# Altium project FlightController_F405.PrjPcb
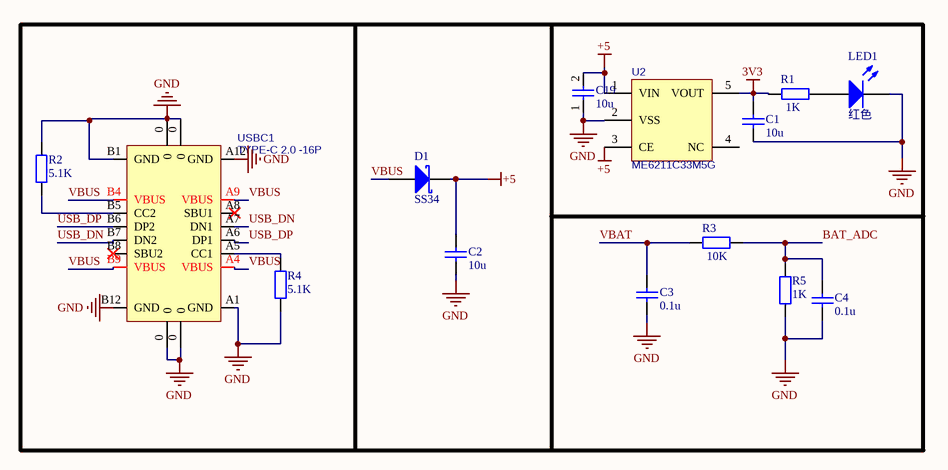
[diagram p0: Power.SchDoc]
4 sheets, 44 parts. Net scope: global (net labels, ports and power ports of the same name join across sheets).
Board file: FlightController_20x20.PcbDoc
Sheets:
  Power.SchDoc
  MCU_System.SchDoc
  IMU_Sensor.SchDoc
  Interfaces.SchDoc

## Sheet Power.SchDoc
size A4; SheetNumber: 1; SheetTotal: 4

### Parts
C1  10u  [C0402_M]
C2  10u  [C0402_M]
C3  0.1u  [C0402_M]
C4  0.1u  [C0402_M]
C19  10u  [C0402_M]
D1  SS34  [SOD-123]
LED1  红色  [LED0603_R]
R1  1K  [R0402_M]
R2  5.1K  [R0402_M]
R3  10K  [R0402_M]
R4  5.1K  [R0402_M]
R5  1K  [R0402_M]
U2  ME6211C33M5G  [SOT-23-5]
USBC1  TYPE-C 2.0 -16P  [USB-C-SMD_16P]

### Nets
3V3: C1.2 R1.1 U2.5(VOUT)
+5: C2.2 C19.2 D1.2(K) U2.1(VIN) U2.3(CE)
GND: C1.1 C2.1 C3.1 C4.2 C19.1 LED1.2(K) R2.2 R4.1 R5.1 U2.2(VSS) USBC1.0 USBC1.A1(GND) USBC1.A12(GND) USBC1.B1(GND) USBC1.B12(GND)
BAT_ADC: C4.1 R3.2 R5.2
USB_DN: USBC1.A7(DN1) USBC1.B7(DN2)
USB_DP: USBC1.A6(DP1) USBC1.B6(DP2)
VBAT: C3.2 R3.1
VBUS: D1.1(A) USBC1.A4(VBUS) USBC1.A9(VBUS) USBC1.B4(VBUS) USBC1.B9(VBUS)
NetLED1_1: LED1.1(A) R1.2
NetR2_1: R2.1 USBC1.B5(CC2)
NetR4_2: R4.2 USBC1.A5(CC1)

Not connected (* = marked no-connect by the designer): U2 4(NC); USBC1 A8(SBU1)* B8(SBU2)*

### Library data of the parts
C1-C4 C19 = C: 贴片电容/MLCC电容; BOM名称: 无极性贴片电容; 当前库版本V2022.12.25 @淘宝卖家:黄晶宝石: 最新版本发布https://shop463601444.taobao.com
D1 = SS34: 肖特基二极管; 属性: 40V/3A; 当前库版本V2022.12.25 @淘宝卖家:黄晶宝石: 最新版本发布https://shop463601444.taobao.com; BOM名称: 肖特基二极管
LED1 = LED: 贴片LED; 封装库来自淘宝卖家：黄晶宝石: 其他店铺购入均为盗版封装库，无更新权益，请立即申请退款，本店现金奖励200~1000元; BOM名称: 贴片LED
R1-R5 = R: 贴片电阻; 联系下单店铺卖家 免费帮你查找封装: 联系下单店铺卖家 免费技术支持; BOM名称: 贴片电阻
U2 = ME6211C33: LDO 3.3V/0.5A; BOM名称: RT9193-30GB; 当前库版本V2022.12.25 @淘宝卖家:黄晶宝石: 最新版本发布https://shop463601444.taobao.com
USBC1 = USB2.0_Type-C_16Pin: USB2.0_Type-C_16Pin母座; 当前库版本V2022.12.25 @淘宝卖家:黄晶宝石: 最新版本发布https://shop463601444.taobao.com

## Sheet MCU_System.SchDoc
size A4; SheetNumber: 2; SheetTotal: 4
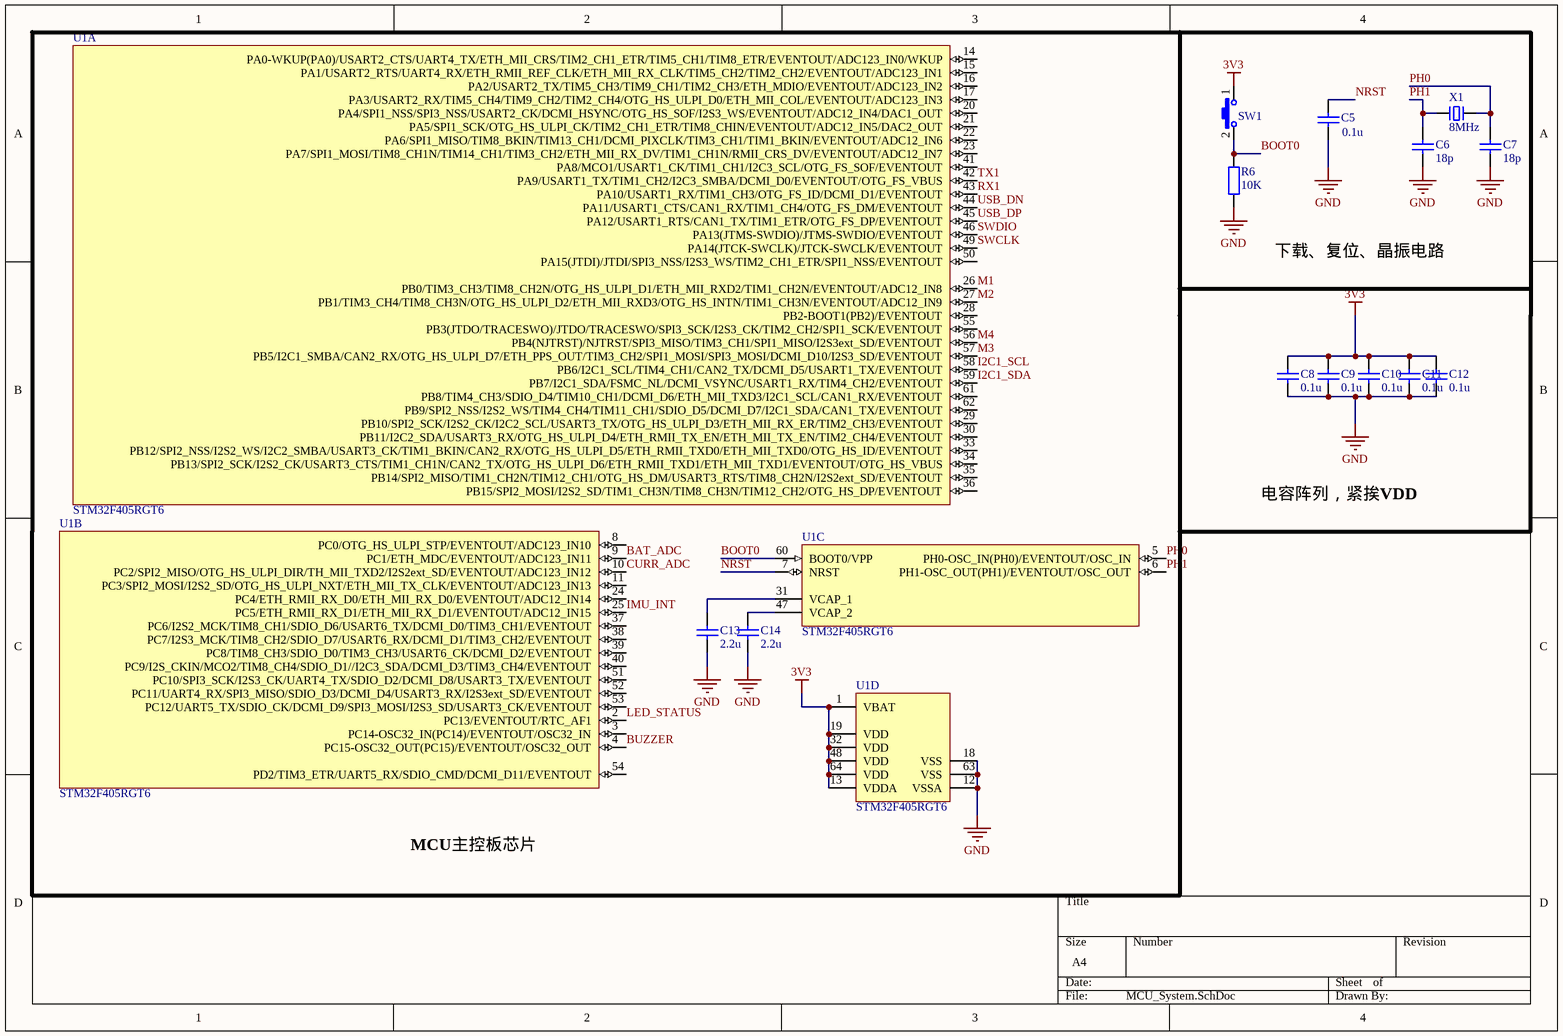
[diagram p1: MCU_System.SchDoc]

### Parts
C5  0.1u  [C0402_M]
C6  18p  [C0402_M]
C7  18p  [C0402_M]
C8  0.1u  [C0402_M]
C9  0.1u  [C0402_M]
C10  0.1u  [C0402_M]
C11  0.1u  [C0402_M]
C12  0.1u  [C0402_M]
C13  2.2u  [C0402_M]
C14  2.2u  [C0402_M]
R6  10K  [R0402_M]
SW1  3x6x5  [SW-SMD-2.8*2.4_4P]  (value not drawn)
U1  STM32F405RGT6  [TQFP64_M]  (parts A,B,C,D of 4)
X1  8MHz  [OSC-3225-4P]

### Nets
3V3: C8.2 C9.2 C10.2 C11.2 C12.2 SW1.1 U1.1(VBAT) U1.13(VDDA) U1.19(VDD) U1.32(VDD) U1.48(VDD) U1.64(VDD)
GND: C5.1 C6.1 C7.1 C8.1 C9.1 C10.1 C11.1 C12.1 C13.1 C14.1 R6.1 U1.12(VSSA) U1.18(VSS) U1.63(VSS)
BAT_ADC: U1.9(PC1/ETH_MDC/EVENTOUT/ADC123_IN11)
BOOT0: R6.2 SW1.2 U1.60(BOOT0/VPP)
BUZZER: U1.4(PC15-OSC32_OUT(PC15)/EVENTOUT/OSC32_OUT)
CURR_ADC: U1.10(PC2/SPI2_MISO/OTG_HS_ULPI_DIR/TH_MII_TXD2/I2S2ext_SD/EVENTOUT/ADC123_IN12)
I2C1_SCL: U1.58(PB6/I2C1_SCL/TIM4_CH1/CAN2_TX/DCMI_D5/USART1_TX/EVENTOUT)
I2C1_SDA: U1.59(PB7/I2C1_SDA/FSMC_NL/DCMI_VSYNC/USART1_RX/TIM4_CH2/EVENTOUT)
IMU_INT: U1.25(PC5/ETH_RMII_RX_D1/ETH_MII_RX_D1/EVENTOUT/ADC12_IN15)
LED_STATUS: U1.2(PC13/EVENTOUT/RTC_AF1)
M1: U1.26(PB0/TIM3_CH3/TIM8_CH2N/OTG_HS_ULPI_D1/ETH_MII_RXD2/TIM1_CH2N/EVENTOUT/ADC12_IN8)
M2: U1.27(PB1/TIM3_CH4/TIM8_CH3N/OTG_HS_ULPI_D2/ETH_MII_RXD3/OTG_HS_INTN/TIM1_CH3N/EVENTOUT/ADC12_IN9)
M3: U1.57(PB5/I2C1_SMBA/CAN2_RX/OTG_HS_ULPI_D7/ETH_PPS_OUT/TIM3_CH2/SPI1_MOSI/SPI3_MOSI/DCMI_D10/I2S3_SD/EVENTOUT)
M4: U1.56(PB4(NJTRST)/NJTRST/SPI3_MISO/TIM3_CH1/SPI1_MISO/I2S3ext_SD/EVENTOUT)
NRST: C5.2 U1.7(NRST)
PH0: C7.2 U1.5(PH0-OSC_IN(PH0)/EVENTOUT/OSC_IN) X1.3
PH1: C6.2 U1.6(PH1-OSC_OUT(PH1)/EVENTOUT/OSC_OUT) X1.1
RX1: U1.43(PA10/USART1_RX/TIM1_CH3/OTG_FS_ID/DCMI_D1/EVENTOUT)
SWCLK: U1.49(PA14(JTCK-SWCLK)/JTCK-SWCLK/EVENTOUT)
SWDIO: U1.46(PA13(JTMS-SWDIO)/JTMS-SWDIO/EVENTOUT)
TX1: U1.42(PA9/USART1_TX/TIM1_CH2/I2C3_SMBA/DCMI_D0/EVENTOUT/OTG_FS_VBUS)
USB_DN: U1.44(PA11/USART1_CTS/CAN1_RX/TIM1_CH4/OTG_FS_DM/EVENTOUT)
USB_DP: U1.45(PA12/USART1_RTS/CAN1_TX/TIM1_ETR/OTG_FS_DP/EVENTOUT)
NetC13_2: C13.2 U1.31(VCAP_1)
NetC14_2: C14.2 U1.47(VCAP_2)

Not connected (* = marked no-connect by the designer): U1 3(PC14-OSC32_IN(PC14)/EVENTOUT/OSC32_IN) 8(PC0/OTG_HS_ULPI_STP/EVENTOUT/ADC123_IN10) 11(PC3/SPI2_MOSI/I2S2_SD/OTG_HS_ULPI_NXT/ETH_MII_TX_CLK/EVENTOUT/ADC123_IN13) 14(PA0-WKUP(PA0)/USART2_CTS/UART4_TX/ETH_MII_CRS/TIM2_CH1_ETR/TIM5_CH1/TIM8_ETR/EVENTOUT/ADC123_IN0/WKUP) 15(PA1/USART2_RTS/UART4_RX/ETH_RMII_REF_CLK/ETH_MII_RX_CLK/TIM5_CH2/TIM2_CH2/EVENTOUT/ADC123_IN1) 16(PA2/USART2_TX/TIM5_CH3/TIM9_CH1/TIM2_CH3/ETH_MDIO/EVENTOUT/ADC123_IN2) 17(PA3/USART2_RX/TIM5_CH4/TIM9_CH2/TIM2_CH4/OTG_HS_ULPI_D0/ETH_MII_COL/EVENTOUT/ADC123_IN3) 20(PA4/SPI1_NSS/SPI3_NSS/USART2_CK/DCMI_HSYNC/OTG_HS_SOF/I2S3_WS/EVENTOUT/ADC12_IN4/DAC1_OUT) 21(PA5/SPI1_SCK/OTG_HS_ULPI_CK/TIM2_CH1_ETR/TIM8_CHIN/EVENTOUT/ADC12_IN5/DAC2_OUT) 22(PA6/SPI1_MISO/TIM8_BKIN/TIM13_CH1/DCMI_PIXCLK/TIM3_CH1/TIM1_BKIN/EVENTOUT/ADC12_IN6) 23(PA7/SPI1_MOSI/TIM8_CH1N/TIM14_CH1/TIM3_CH2/ETH_MII_RX_DV/TIM1_CH1N/RMII_CRS_DV/EVENTOUT/ADC12_IN7) 24(PC4/ETH_RMII_RX_D0/ETH_MII_RX_D0/EVENTOUT/ADC12_IN14) 28(PB2-BOOT1(PB2)/EVENTOUT) 29(PB10/SPI2_SCK/I2S2_CK/I2C2_SCL/USART3_TX/OTG_HS_ULPI_D3/ETH_MII_RX_ER/TIM2_CH3/EVENTOUT) 30(PB11/I2C2_SDA/USART3_RX/OTG_HS_ULPI_D4/ETH_RMII_TX_EN/ETH_MII_TX_EN/TIM2_CH4/EVENTOUT) 33(PB12/SPI2_NSS/I2S2_WS/I2C2_SMBA/USART3_CK/TIM1_BKIN/CAN2_RX/OTG_HS_ULPI_D5/ETH_RMII_TXD0/ETH_MII_TXD0/OTG_HS_ID/EVENTOUT) 34(PB13/SPI2_SCK/I2S2_CK/USART3_CTS/TIM1_CH1N/CAN2_TX/OTG_HS_ULPI_D6/ETH_RMII_TXD1/ETH_MII_TXD1/EVENTOUT/OTG_HS_VBUS) 35(PB14/SPI2_MISO/TIM1_CH2N/TIM12_CH1/OTG_HS_DM/USART3_RTS/TIM8_CH2N/I2S2ext_SD/EVENTOUT) 36(PB15/SPI2_MOSI/I2S2_SD/TIM1_CH3N/TIM8_CH3N/TIM12_CH2/OTG_HS_DP/EVENTOUT) 37(PC6/I2S2_MCK/TIM8_CH1/SDIO_D6/USART6_TX/DCMI_D0/TIM3_CH1/EVENTOUT) 38(PC7/I2S3_MCK/TIM8_CH2/SDIO_D7/USART6_RX/DCMI_D1/TIM3_CH2/EVENTOUT) 39(PC8/TIM8_CH3/SDIO_D0/TIM3_CH3/USART6_CK/DCMI_D2/EVENTOUT) 40(PC9/I2S_CKIN/MCO2/TIM8_CH4/SDIO_D1//I2C3_SDA/DCMI_D3/TIM3_CH4/EVENTOUT) 41(PA8/MCO1/USART1_CK/TIM1_CH1/I2C3_SCL/OTG_FS_SOF/EVENTOUT) 50(PA15(JTDI)/JTDI/SPI3_NSS/I2S3_WS/TIM2_CH1_ETR/SPI1_NSS/EVENTOUT) 51(PC10/SPI3_SCK/I2S3_CK/UART4_TX/SDIO_D2/DCMI_D8/USART3_TX/EVENTOUT) 52(PC11/UART4_RX/SPI3_MISO/SDIO_D3/DCMI_D4/USART3_RX/I2S3ext_SD/EVENTOUT) 53(PC12/UART5_TX/SDIO_CK/DCMI_D9/SPI3_MOSI/I2S3_SD/USART3_CK/EVENTOUT) 54(PD2/TIM3_ETR/UART5_RX/SDIO_CMD/DCMI_D11/EVENTOUT) 55(PB3(JTDO/TRACESWO)/JTDO/TRACESWO/SPI3_SCK/I2S3_CK/TIM2_CH2/SPI1_SCK/EVENTOUT) 61(PB8/TIM4_CH3/SDIO_D4/TIM10_CH1/DCMI_D6/ETH_MII_TXD3/I2C1_SCL/CAN1_RX/EVENTOUT) 62(PB9/SPI2_NSS/I2S2_WS/TIM4_CH4/TIM11_CH1/SDIO_D5/DCMI_D7/I2C1_SDA/CAN1_TX/EVENTOUT)

### Notes on the sheet
- 下载、复位、晶振电路
- 电容阵列，紧挨VDD
- MCU主控板芯片

### Library data of the parts
C5-C14 = C: as C1 on sheet Power
R6 = R: 贴片电阻; 联系下单店铺卖家 免费帮你查找封装: 联系下单店铺卖家 免费技术支持; BOM名称: 贴片电阻
SW1 = SW-PB: 微动开关; BOM名称: 3x6轻触开关; 联系下单店铺卖家 免费技术支持: 联系下单店铺卖家 免费帮你查找封装
U1 = STM32F405RGT6: ARM Cortex-M4 32b MCU+FPU, 210DMIP, 1024 kB Flash, 192+4 kB RAM, 51 I/Os, 64-pin LQFP, -40 to +85癈, Tray; Internal RAM: 192kB; Operating Frequency (Processor Speed): 168MHz; A/D Converter: 16x12-bit; D/A Converter: 2x12-bit; 16-bit Timers (IC/OC/PWM): 12x16-bit(24/24/30); 32-bit Timer (IC/OC/PWM): 2x32-bit (8/8/8); Other Timer Functions: 2xWDG, RTC, 24-bit down counter; Serial Interface: 3xSPI/2xI2S/2xI2C/3xUSART(IrDa, ISO7816)/3xUART/1xUSB OTG FS/HS, 2xCAN/ SDIO; 联系卖家，免费查找封装: 唯一出售店铺网址https://shop463601444.taobao.com; DatasheetVersion: rev2, Jan-2012; PackageVersion: 2012; PackageReference: TQFP64; PackageDescription: 64-Pin Low Profile Quad Flat Package, 10x10 mm Body, 0.5 mm Pitch; ComponentLink1Description: Manufacturer URL; ComponentLink1URL: http://www.st.com/; ComponentLink2Description: STM32F405/7 Datasheet; ComponentLink2URL: http://www.st.com/internet/com/TECHNICAL_RESOURCES/TECHNICAL_LITERATURE/DATASHEET/DM00037051.pdf; ComponentLink3Description: STM32F4 Web Page; ComponentLink3URL: http://www.st.com/internet/mcu/subclass/1521.jsp
X1 = XTAL-2P: 2脚无源晶振(谐振器）; 联系下单店铺卖家 免费帮你查找封装: 联系下单店铺卖家 免费技术支持; BOM名称: 2脚无源晶振(谐振器）

## Sheet IMU_Sensor.SchDoc
size A4; SheetNumber: 3; SheetTotal: 4
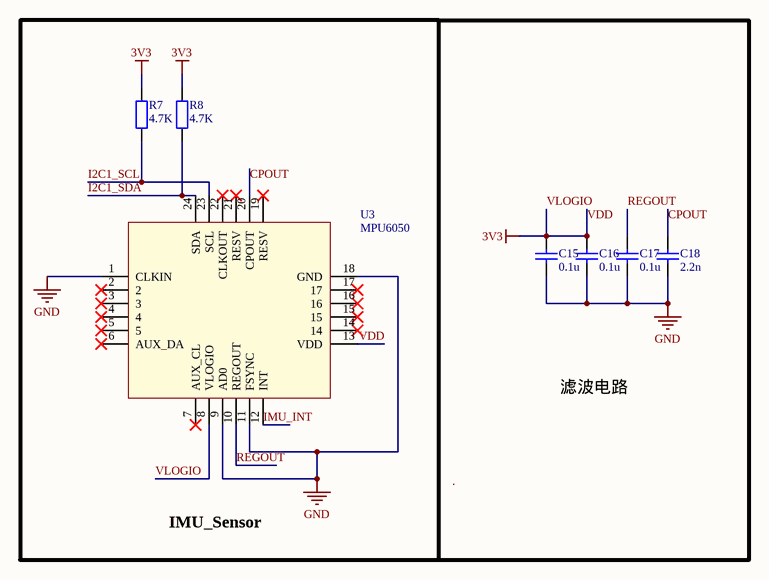
[diagram p2: IMU_Sensor.SchDoc]

### Parts
C15  0.1u  [C0402_M]
C16  0.1u  [C0402_M]
C17  0.1u  [C0402_M]
C18  2.2n  [C0402_M]
R7  4.7K  [R0402_M]
R8  4.7K  [R0402_M]
U3  MPU6050  [QFN-24_L4.0-W4.0-P0.50-BL-EP2.7]

### Nets
3V3: C15.2 C16.2 R7.2 R8.2 U3.8(VLOGIO) U3.13(VDD)  [also labelled VDD, VLOGIO]
GND: C15.1 C16.1 C17.1 C18.1 U3.1(CLKIN) U3.9(AD0) U3.11(FSYNC) U3.18(GND)
CPOUT: C18.2 U3.20(CPOUT)
I2C1_SCL: R7.1 U3.23(SCL)
I2C1_SDA: R8.1 U3.24(SDA)
IMU_INT: U3.12(INT)
REGOUT: C17.2 U3.10(REGOUT)

Not connected (* = marked no-connect by the designer): U3 2* 3* 4* 5* 6(AUX_DA)* 7(AUX_CL)* 14* 15* 16* 17* 19(RESV)* 21(RESV)* 22(CLKOUT)*

### Notes on the sheet
- 滤波电路
- IMU_Sensor
- Labels drawn without touching a wire or pin: ·

### Library data of the parts
C15-C18 = C: as C1 on sheet Power
R7 R8 = R: 贴片电阻; 联系下单店铺卖家 免费帮你查找封装: 联系下单店铺卖家 免费技术支持; BOM名称: 贴片电阻
U3 = MPU6050: 三轴加速度+三轴陀螺仪; 封装库来自淘宝卖家：黄晶宝石: 其他店铺购入均为盗版封装库，请立即申请退款，本店现金奖励100~500元; BOM名称: MPU6050

## Sheet Interfaces.SchDoc
size A4; SheetNumber: 4; SheetTotal: 4
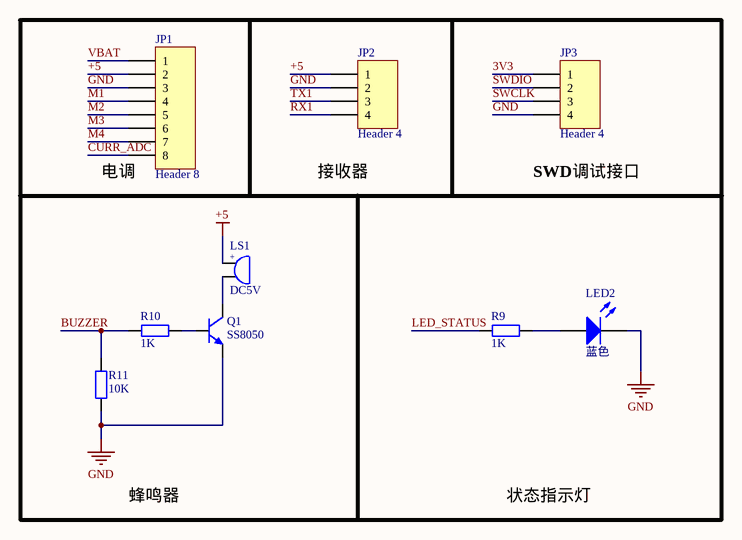
[diagram p3: Interfaces.SchDoc]

### Parts
JP1  Header 8  [SH1.0-WT-8P]
JP2  Header 4  [PAD-1X4-SMD]
JP3  Header 4  [PAD-1X4-SMD]
LED2  蓝色  [LED0603_B]
LS1  DC5V  [BUZZER]
Q1  SS8050  [SOT23-3L]
R9  1K  [R0402_M]
R10  1K  [R0402_M]
R11  10K  [R0402_M]

### Nets
3V3: JP3.1
+5: JP1.2 JP2.1 LS1.1
GND: JP1.3 JP2.2 JP3.4 LED2.2(K) Q1.2(E) R11.1
BUZZER: R10.1 R11.2
CURR_ADC: JP1.8
LED_STATUS: R9.1
M1: JP1.4
M2: JP1.5
M3: JP1.6
M4: JP1.7
RX1: JP2.4
SWCLK: JP3.3
SWDIO: JP3.2
TX1: JP2.3
VBAT: JP1.1
NetLED2_1: LED2.1(A) R9.2
NetLS1_2: LS1.2 Q1.3(C)
NetQ1_1: Q1.1(B) R10.2

### Notes on the sheet
- (near JP1) 电调
- (near JP2) 接收器
- (near JP3) SWD调试接口
- 蜂鸣器
- 状态指示灯
- (in symbol BEEP) +

### Library data of the parts
JP1 = Header 8: Header, 8-Pin; Revision: 17-Jul-2002: Re-released for DXP Platform.; Publisher: Altium Limited
JP2 JP3 = Header 4: Header, 4-Pin; Revision: 17-Jul-2002: Re-released for DXP Platform.; Publisher: Altium Limited
LED2 = LED: as LED1 on sheet Power; BOM名称: 贴片LED
LS1 = BEEP: 蜂鸣器; 联系下单店铺卖家 免费技术支持: 联系下单店铺卖家 免费帮你查找封装; BOM名称: 蜂鸣器
Q1 = 8050-SMD: 高频放大-NPN型; 参数: 40V 1.5A 1W 100MHZ; 联系下单店铺卖家 免费帮你查找封装: 联系下单店铺卖家 免费技术支持; BOM名称: 高频放大-NPN型
R9-R11 = R: 贴片电阻; 联系下单店铺卖家 免费帮你查找封装: 联系下单店铺卖家 免费技术支持; BOM名称: 贴片电阻

## Nets that join several sheets
3V3: Power (C1.2 R1.1 U2.5), MCU_System (12 pins), IMU_Sensor (6 pins), Interfaces (JP3.1)
+5: Power (5 pins), Interfaces (JP1.2 JP2.1 LS1.1)
GND: Power (15 pins), MCU_System (14 pins), IMU_Sensor (8 pins), Interfaces (6 pins)
BAT_ADC: Power (C4.1 R3.2 R5.2), MCU_System (U1.9)
BUZZER: MCU_System (U1.4), Interfaces (R10.1 R11.2)
CURR_ADC: MCU_System (U1.10), Interfaces (JP1.8)
I2C1_SCL: MCU_System (U1.58), IMU_Sensor (R7.1 U3.23)
I2C1_SDA: MCU_System (U1.59), IMU_Sensor (R8.1 U3.24)
IMU_INT: MCU_System (U1.25), IMU_Sensor (U3.12)
LED_STATUS: MCU_System (U1.2), Interfaces (R9.1)
M1: MCU_System (U1.26), Interfaces (JP1.4)
M2: MCU_System (U1.27), Interfaces (JP1.5)
M3: MCU_System (U1.57), Interfaces (JP1.6)
M4: MCU_System (U1.56), Interfaces (JP1.7)
RX1: MCU_System (U1.43), Interfaces (JP2.4)
SWCLK: MCU_System (U1.49), Interfaces (JP3.3)
SWDIO: MCU_System (U1.46), Interfaces (JP3.2)
TX1: MCU_System (U1.42), Interfaces (JP2.3)
USB_DN: Power (USBC1.A7 USBC1.B7), MCU_System (U1.44)
USB_DP: Power (USBC1.A6 USBC1.B6), MCU_System (U1.45)
VBAT: Power (C3.2 R3.1), Interfaces (JP1.1)